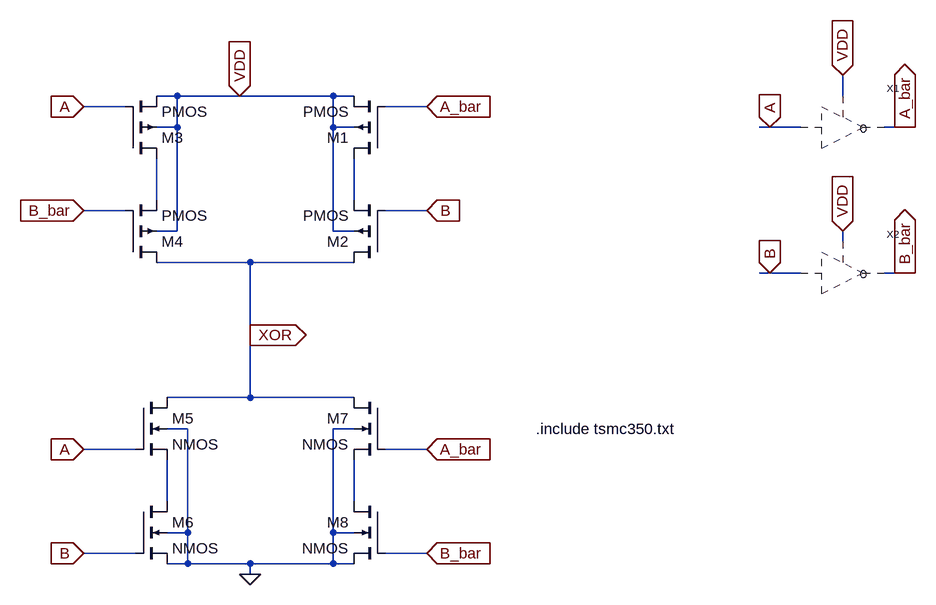
[diagram p0: schematic XOR.asc]
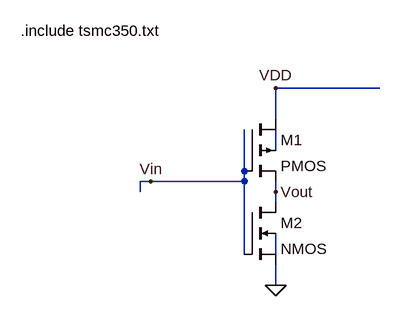
[diagram p1: sub-circuit symb.asc]
XOR.asc, the LTspice schematic file:
Version 4
SHEET 1 1976 944
WIRE 464 48 432 48
WIRE 560 48 464 48
WIRE 704 48 560 48
WIRE 736 48 704 48
WIRE 1488 48 1488 16
WIRE 384 64 320 64
WIRE 848 64 784 64
WIRE 464 96 464 48
WIRE 464 96 432 96
WIRE 704 96 704 48
WIRE 736 96 704 96
WIRE 1376 96 1360 96
WIRE 1424 96 1376 96
WIRE 1584 96 1552 96
WIRE 1600 96 1584 96
WIRE 432 208 432 144
WIRE 736 208 736 144
WIRE 384 224 320 224
WIRE 848 224 784 224
WIRE 464 256 464 96
WIRE 464 256 432 256
WIRE 704 256 704 96
WIRE 736 256 704 256
WIRE 1488 272 1488 256
WIRE 576 304 432 304
WIRE 736 304 576 304
WIRE 1376 320 1360 320
WIRE 1424 320 1376 320
WIRE 1584 320 1552 320
WIRE 1600 320 1584 320
WIRE 576 416 576 304
WIRE 576 512 576 416
WIRE 576 512 448 512
WIRE 736 512 576 512
WIRE 480 560 448 560
WIRE 736 560 704 560
WIRE 400 592 320 592
WIRE 848 592 784 592
WIRE 448 672 448 608
WIRE 736 672 736 608
WIRE 480 720 480 560
WIRE 480 720 448 720
WIRE 704 720 704 560
WIRE 736 720 704 720
WIRE 400 752 320 752
WIRE 848 752 784 752
WIRE 480 768 480 720
WIRE 480 768 448 768
WIRE 576 768 480 768
WIRE 704 768 704 720
WIRE 704 768 576 768
WIRE 736 768 704 768
WIRE 576 784 576 768
FLAG 320 592 A
IOPIN 320 592 In
FLAG 320 752 B
IOPIN 320 752 In
FLAG 848 592 A_bar
IOPIN 848 592 In
FLAG 848 752 B_bar
IOPIN 848 752 In
FLAG 320 64 A
IOPIN 320 64 In
FLAG 320 224 B_bar
IOPIN 320 224 In
FLAG 848 64 A_bar
IOPIN 848 64 In
FLAG 848 224 B
IOPIN 848 224 In
FLAG 560 48 VDD
IOPIN 560 48 In
FLAG 576 416 XOR
IOPIN 576 416 Out
FLAG 576 784 0
FLAG 1488 16 VDD
IOPIN 1488 16 In
FLAG 1488 256 VDD
IOPIN 1488 256 In
FLAG 1376 96 A
IOPIN 1376 96 In
FLAG 1376 320 B
IOPIN 1376 320 In
FLAG 1584 96 A_bar
IOPIN 1584 96 Out
FLAG 1584 320 B_bar
IOPIN 1584 320 Out
SYMBOL pmos4 784 144 R180
SYMATTR InstName M1
SYMATTR Value2 l=350n w=2.5u
SYMBOL pmos4 784 304 R180
SYMATTR InstName M2
SYMATTR Value2 l=350n w=2.5u
SYMBOL pmos4 384 144 M180
SYMATTR InstName M3
SYMATTR Value2 l=350n w=2.5u
SYMBOL pmos4 384 304 M180
SYMATTR InstName M4
SYMATTR Value2 l=350n w=2.5u
SYMBOL nmos4 400 512 R0
SYMATTR InstName M5
SYMATTR Value2 l=350n w=1u
SYMBOL nmos4 400 672 R0
SYMATTR InstName M6
SYMATTR Value2 l=350n w=1u
SYMBOL nmos4 784 512 M0
SYMATTR InstName M7
SYMATTR Value2 l=350n w=1u
SYMBOL nmos4 784 672 M0
SYMATTR InstName M8
SYMATTR Value2 l=350n w=1u
SYMBOL symb 1488 96 R0
SYMATTR InstName X1
SYMBOL symb 1488 320 R0
SYMATTR InstName X2
TEXT 1016 560 Left 2 !.include tsmc350.txt

symb.asc, the sub-circuit schematic file:
Version 4
SHEET 1 880 680
WIRE 560 176 400 176
WIRE 400 224 400 176
WIRE 400 272 400 240
WIRE 352 304 352 240
WIRE 208 320 192 320
WIRE 352 320 352 304
WIRE 352 320 208 320
WIRE 192 336 192 320
WIRE 400 336 400 320
WIRE 400 352 400 336
WIRE 352 432 352 320
WIRE 400 432 400 400
WIRE 400 480 400 448
FLAG 400 480 0
FLAG 208 320 Vin
FLAG 400 176 VDD
FLAG 400 336 Vout
SYMBOL pmos4 352 224 R0
SYMATTR InstName M1
SYMATTR Value2 l=350n w=2u
SYMBOL nmos4 352 352 R0
SYMATTR InstName M2
SYMATTR Value2 l=350n w=1u
TEXT 8 88 Left 2 !.include tsmc350.txt

The netlist it stands for:
* XOR.asc
M1 N002 A_bar VDD VDD PMOS l=350n w=2.5u
M2 XOR B N002 VDD PMOS l=350n w=2.5u
M3 N001 A VDD VDD PMOS l=350n w=2.5u
M4 XOR B_bar N001 VDD PMOS l=350n w=2.5u
M5 XOR A N003 0 NMOS l=350n w=1u
M6 N003 B 0 0 NMOS l=350n w=1u
M7 XOR A_bar N004 0 NMOS l=350n w=1u
M8 N004 B_bar 0 0 NMOS l=350n w=1u
XX1 A VDD A_bar symb
XX2 B VDD B_bar symb

* block symbol definitions
.subckt symb Vin VDD Vout
M1 VDD Vin Vout N001 PMOS l=350n w=2u
M2 Vout Vin 0 N002 NMOS l=350n w=1u
.include tsmc350.txt
.ends symb

.model NMOS NMOS
.model PMOS PMOS
.lib standard.mos
.include tsmc350.txt
.backanno
.end